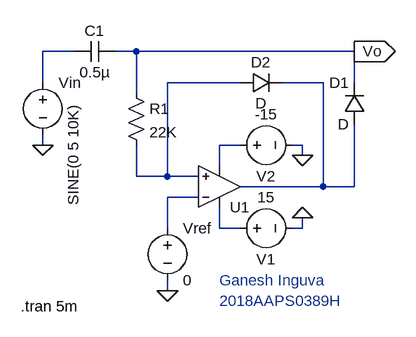
[diagram p0: schematic Run_4.asc]
Run_4.asc, the LTspice schematic file:
Version 4
SHEET 1 880 680
WIRE 16 -112 -32 -112
WIRE 112 -112 80 -112
WIRE 448 -112 112 -112
WIRE -32 -64 -32 -112
WIRE 272 -64 160 -64
WIRE 400 -64 336 -64
WIRE 448 -64 448 -112
WIRE 112 -48 112 -112
WIRE -32 32 -32 16
WIRE 272 32 240 32
WIRE 368 32 352 32
WIRE 368 48 368 32
WIRE 240 64 240 32
WIRE 112 80 112 32
WIRE 160 80 160 -64
WIRE 160 80 112 80
WIRE 208 80 160 80
WIRE 400 96 400 -64
WIRE 400 96 272 96
WIRE 448 96 448 0
WIRE 448 96 400 96
WIRE 208 112 160 112
WIRE 160 160 160 112
WIRE 240 160 240 128
WIRE 272 160 240 160
WIRE 368 160 368 144
WIRE 368 160 352 160
WIRE 160 256 160 240
FLAG 368 48 0
FLAG 368 144 0
FLAG 160 256 0
FLAG -32 32 0
FLAG 448 -112 Vo
IOPIN 448 -112 Out
SYMBOL OpAmps\\UniversalOpamp2 240 96 M180
SYMATTR InstName U1
SYMBOL voltage 256 160 M90
WINDOW 0 32 56 VTop 2
WINDOW 3 -32 56 VBottom 2
WINDOW 123 0 0 Left 0
WINDOW 39 0 0 Left 0
SYMATTR InstName V1
SYMATTR Value 15
SYMBOL voltage 256 32 M90
WINDOW 0 32 56 VTop 2
WINDOW 3 -32 56 VBottom 2
WINDOW 123 0 0 Left 0
WINDOW 39 0 0 Left 0
SYMATTR InstName V2
SYMATTR Value -15
SYMBOL diode 272 -48 R270
WINDOW 0 32 32 VTop 2
WINDOW 3 0 32 VBottom 2
SYMATTR InstName D2
SYMBOL voltage 160 144 R0
WINDOW 123 0 0 Left 0
WINDOW 39 0 0 Left 0
SYMATTR InstName Vref
SYMATTR Value 0
SYMBOL res 96 -64 R0
SYMATTR InstName R1
SYMATTR Value 22K
SYMBOL diode 464 0 R180
WINDOW 0 24 64 Left 2
WINDOW 3 24 0 Left 2
SYMATTR InstName D1
SYMBOL cap 80 -128 R90
WINDOW 0 0 32 VBottom 2
WINDOW 3 32 32 VTop 2
SYMATTR InstName C1
SYMATTR Value 0.5µ
SYMBOL voltage -32 -80 R0
WINDOW 3 47 50 VRight 2
WINDOW 123 0 0 Left 0
WINDOW 39 0 0 Left 0
SYMATTR InstName Vin
SYMATTR Value SINE(0 5 10K)
TEXT -66 280 Left 2 !.tran 5m
TEXT 240 240 Left 2 ;Ganesh Inguva\n2018AAPS0389H

The netlist it stands for:
* Run_4.asc
XU1 N002 N005 N006 N004 N003 level.2 Avol=1Meg GBW=10Meg Slew=10Meg ilimit=25m rail=0 Vos=0 phimargin=45 en=0 enk=0 in=0 ink=0 Rin=500Meg  ; pins IN+ IN- V+ V- OUT
V1 N006 0 15
V2 N004 0 -15
D2 N002 N003 D
Vref N005 0 0
R1 Vo N002 22K
D1 N003 Vo D
C1 Vo N001 0.5µ
Vin N001 0 SINE(0 5 10K)
.model D D
.lib standard.dio
.tran 5m
* Ganesh Inguva
* 2018AAPS0389H
.lib UniversalOpamps2.sub
.backanno
.end